# EAGLE design facedancer21+ (EAGLE 7.1.0)
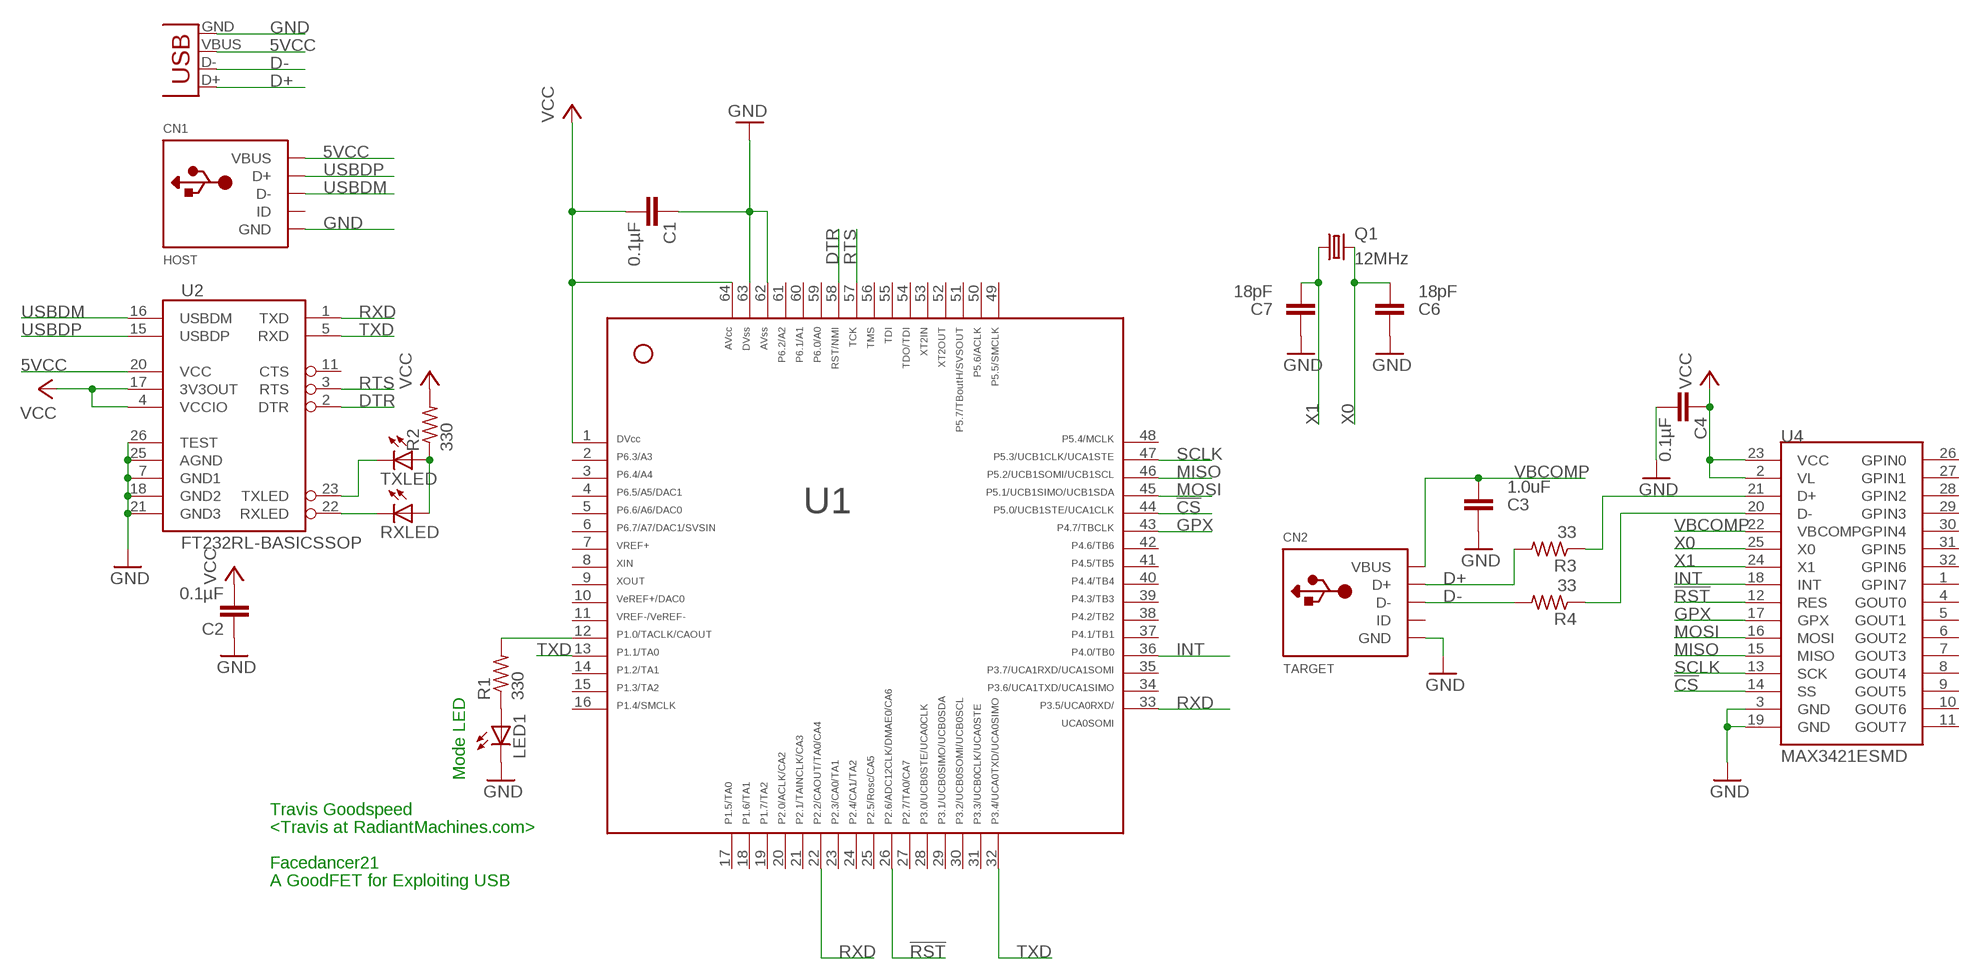
[diagram p0: schematic, sheet 1]

## Parts
C1  0.1µF  C-EUC0603  [C0603]
C2  0.1µF  C-EUC0603  [C0603]
C3  1.0uF  C-EUC0603  [C0603]
C4  0.1µF  C-EUC0603  [C0603]
C6  18pF  C-EUC0603  [C0603]
C7  18pF  C-EUC0603  [C0603]
CN1  HOST  USBMINIB  [USB-MINIB]
CN2  TARGET  USBMINIB  [USB-MINIB]
CN3  USB-A-S  [USB-A-S]
LED1  LEDCHIP-LED0603  [CHIP-LED0603]
Q1  12MHz  CRYSTALHC49UP  [HC49UP]
R1  330  R-US_R0603  [R0603]
R2  330  R-US_R0603  [R0603]
R3  33  R-US_R0603  [R0603]
R4  33  R-US_R0603  [R0603]
RXLED  LEDCHIP-LED0603  [CHIP-LED0603]
TXLED  LEDCHIP-LED0603  [CHIP-LED0603]
U1  F261X---PM64  [PM/PAG64]
U2  FT232RL-BASICSSOP  [SSOP28DB]
U4  MAX3421ESMD  [TQFP32-5MM]

## Nets
5VCC: CN1.VBUS CN3.VBUS U2.20(VCC)
!CS: U1.44 U4.14(SS)
!RST: U1.26 U4.12(RES)
D+: CN2.D+ CN3.D+ R3.2
D-: CN2.D- CN3.D- R4.2
DMINUS: R4.1 U4.20(D-)
DPLUS: R3.1 U4.21(D+)
DTR: U1.58 U2.2(DTR)
GND: C1.1 C2.1 C3.1 C4.2 C6.1 C7.1 CN1.GND CN2.GND CN3.GND LED1.C U1.62 U1.63 U2.7(GND1) U2.18(GND2) U2.21(GND3) U2.25(AGND) U2.26(TEST) U4.3(GND) U4.19(GND)
GPX: U1.43 U4.17(GPX)
INT: U1.36 U4.18(INT)
MISO: U1.46 U4.15(MISO)
MOSI: U1.45 U4.16(MOSI)
N$1: R1.2 U1.12
N$2: LED1.A R1.1
N$6: RXLED.C U2.22(RXLED)
N$7: TXLED.C U2.23(TXLED)
N$8: R2.1 RXLED.A TXLED.A
RTS: U1.57 U2.3(RTS)
RXD: U1.22 U1.33 U2.1(TXD)
SCLK: U1.47 U4.13(SCK)
TXD: U1.13 U1.32 U2.5(RXD)
USBDM: CN1.D- U2.16(USBDM)
USBDP: CN1.D+ U2.15(USBDP)
VBCOMP: C3.2 CN2.VBUS U4.22(VBCOMP)
VCC: C1.2 C2.2 C4.1 R2.2 U1.1 U1.64 U2.4(VCCIO) U2.17(3V3OUT) U4.2(VL) U4.23(VCC)
X0: C6.2 Q1.2 U4.25(X0)
X1: C7.2 Q1.1 U4.24(X1)
Unconnected: CN1.ID CN2.ID U1.2 U1.3 U1.4 U1.5 U1.6 U1.7 U1.8 U1.9 U1.10 U1.11 U1.14 U1.15 U1.16 U1.17 U1.18 U1.19 U1.20 U1.21 U1.23 U1.24 U1.25 U1.27 U1.28 U1.29 U1.30 U1.31 U1.34 U1.35 U1.37 U1.38 U1.39 U1.40 U1.41 U1.42 U1.48 U1.49 U1.50 U1.51 U1.52 U1.53 U1.54 U1.55 U1.56 U1.59 U1.60 U1.61 U2.11(CTS) U4.1(GPIN7) U4.4(GOUT0) U4.5(GOUT1) U4.6(GOUT2) U4.7(GOUT3) U4.8(GOUT4) U4.9(GOUT5) U4.10(GOUT6) U4.11(GOUT7) U4.26(GPIN0) U4.27(GPIN1) U4.28(GPIN2) U4.29(GPIN3) U4.30(GPIN4) U4.31(GPIN5) U4.32(GPIN6)

## Notes on the sheet
- Mode LED
- Travis Goodspeed
- <Travis at RadiantMachines.com>
- Facedancer21
- A GoodFET for Exploiting USB

## Library data of the parts
C1-C4 C6 C7 = rcl:C-EU: CAPACITOR, European symbol
CN1 CN2 = adafruit:USB: USB Connectors USBMINIB - Surface Mount Female Mini-B USB Connector 4UConnector: 06564 By microbuilder.eu Thru-hole RA Female Mini-B USB Connector 4UConnector: 18732 By ladyada.net
CN3 = SparkFun-Connectors:USB: USB Connectors USB-B-PTH is fully proven SKU : PRT-00139/CONN-08278 USB-miniB is fully proven SKU : PRT-00587 USB-A-PCB is untested. USB-A-H is throughly reviewed, but untested. Spark Fun Electronics SKU : PRT-00437 USB-B-SMT is throughly reviewed, but untested. Needs silkscreen touching up. USB-A-S has not been used/tested USB-MB-H has not been used/tested USB-MICROB has been used. CONN-09505
LED1 RXLED TXLED = led:LED: LED OSRAM: - CHIPLED LG R971, LG N971, LY N971, LG Q971, LY Q971, LO R971, LY R971 LH N974, LH R974 LS Q976, LO Q976, LY Q976 LO Q996 - Hyper CHIPLED LW Q18S LB Q993, LB Q99A, LB R99A - SideLED LS A670, LO A670, LY A670, LG A670, LP A670 LB A673, LV A673, LT A673, LW A673 LH A674 LY A675 LS A676, LA A676, LO A676, LY A676, LW A676 LS A679, LY A679, LG A679 - Hyper Micro SIDELED® LS Y876, LA Y876, LO Y876, LY Y876 LT Y87S - SmartLED LW L88C, LW L88S LB L89C, LB L89S, LG L890 LS L89K, LO L89K, LY L89K LS L896, LA L896, LO L896, LY L896 - TOPLED LS T670, LO T670, LY T670, LG T670, LP T670 LSG T670, LSP T670, LSY T670, LOP T670, LYG T670 LG T671, LOG T671, LSG T671 LB T673, LV T673, LT T673, LW T673 LH T674 LS T676, LA T676, LO T676, LY T676, LB T676, LH T676, LSB T676, LW T676 LB T67C, LV T67C, LT T67C, LS T67K, LO T67K, LY T67K, LW E67C LS E67B, LA E67B, LO E67B, LY E67B, LB E67C, LV E67C, LT E67C LW T67C LS T679, LY T679, LG T679 LS T770, LO T770, LY T770, LG T770, LP T770 LB T773, LV T773, LT T773, LW T773 LH T774 LS E675, LA E675, LY E675, LS T675 LS T776, LA T776, LO T776, LY T776, LB T776 LHGB T686 LT T68C, LB T68C - Hyper Mini TOPLED® LB M676 - Mini TOPLED Santana® LG M470 LS M47K, LO M47K, LY M47K Source: http://www.osram.convergy.de LUXEON: - LUMILED® LXK2-PW12-R00, LXK2-PW12-S00, LXK2-PW14-U00, LXK2-PW14-V00 LXK2-PM12-R00, LXK2-PM12-S00, LXK2-PM14-U00 LXK2-PE12-Q00, LXK2-PE12-R00, LXK2-PE12-S00, LXK2-PE14-T00, LXK2-PE14-U00 LXK2-PB12-K00, LXK2-PB12-L00, LXK2-PB12-M00, LXK2-PB14-N00, LXK2-PB14-P00, LXK2-PB14-Q00 LXK2-PR12-L00, LXK2-PR12-M00, LXK2-PR14-Q00, LXK2-PR14-R00 LXK2-PD12-Q00, LXK2-PD12-R00, LXK2-PD12-S00 LXK2-PH12-R00, LXK2-PH12-S00 LXK2-PL12-P00, LXK2-PL12-Q00, LXK2-PL12-R00 Source: www.luxeon.com KINGBRIGHT: KA-3528ASYC Source: www.kingbright.com
Q1 = crystal:CRYSTAL: CRYSTAL; OC_FARNELL: unknown; OC_NEWARK: unknown
R1-R4 = rcl:R-US_: RESISTOR, American symbol
U1 = TI_MSP430_v13:F261X---PM64: ***MSP430F261x***PM64
U2 = SparkFun:FT232RL-BASIC: USB UART This is the simplified version of the FT232RL unit. Only what you need, nothing you don't. Spark Fun Electronics SKU : COM-00650
U4 = SparkFun-DigitalIC:MAX3421E: USB Peripheral/Host Controller w/ SPI

## Board
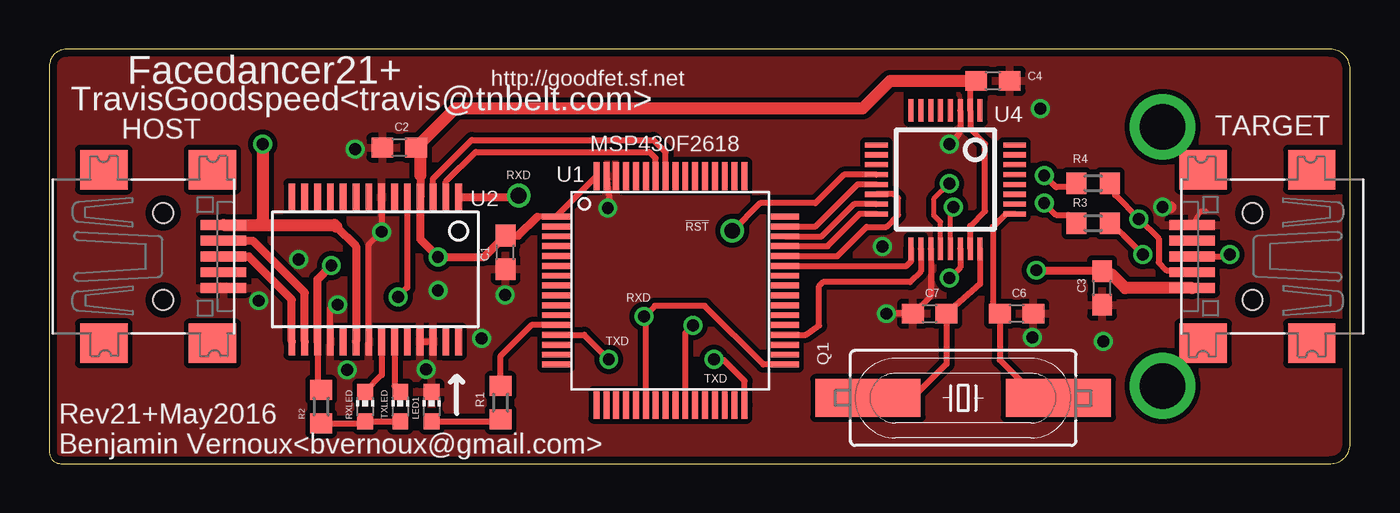
[diagram p1: board, top side]
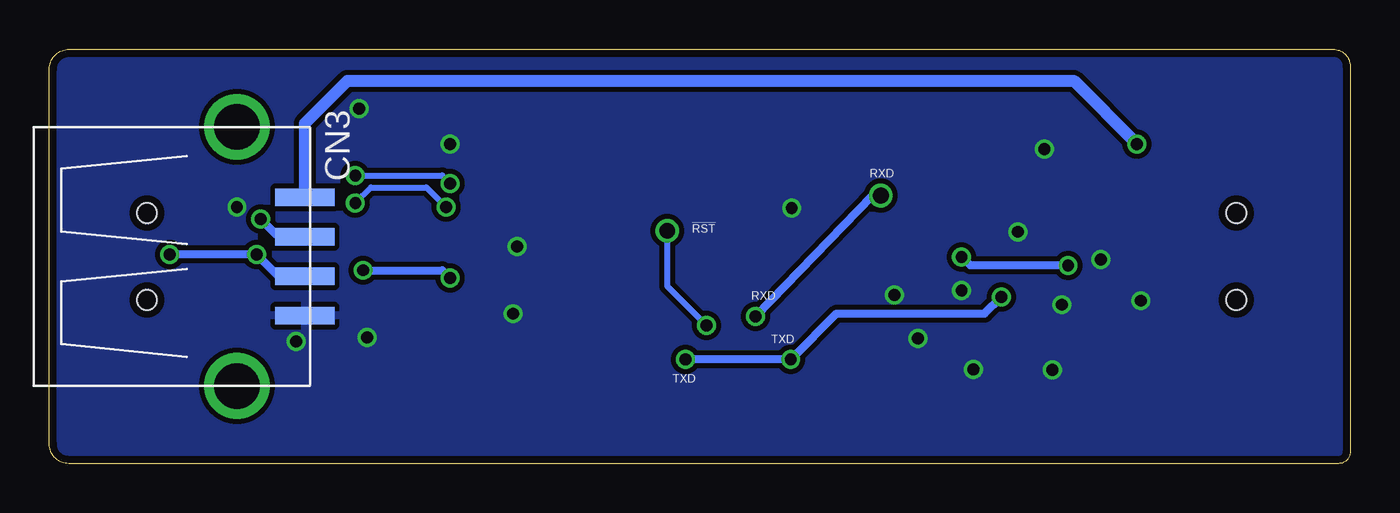
[diagram p2: board, bottom side, seen from below]

Size 65.9 x 21 mm. Coordinates in mm from the lower left corner, seen from the top.
Outline: 64.89,21 0.85,21 arc90 0,20.15 0,0.57 arc90 0.57,0 64.92,0 arc90 65.9,0.98 65.9,19.99 arc90 64.89,21
Copper layers (1*16): Top 0.0356mm / dielectric 1.5011mm / Bottom 0.0356mm
Design rules "oshpark-2layer": minimum track width 6mil, minimum drill 13mil, track to track 6mil, track to pad 6mil, pad to pad 6mil, via to via 6mil, smd to smd 6mil, copper to edge 15mil, drill to drill 6mil, minimum pad ring 7mil, minimum via ring 7mil, stop-mask expansion 2.5mil, vias tented up to drill 0mil, thermal gap 10mil

### Footprints (pad centres in the part's own frame; a part is rotated, then mirrored left to right if it is on the bottom)
C0603 = smd 1.1 x 1: 1 -0.85,0; 2 0.85,0
USB-MINIB = smd 0.5 x 2.308: D+ 0,4.064; D- -0.8,4.064; GND 1.6,4.064; ID 0.8,4.064; VBUS -1.6,4.064 | smd 2 x 2.4: GND1 -4.4,-2; GND2 -4.4,3.5; GND3 4.4,3.5; GND4 4.4,-2 | hole 1: -2.2,1; 2.2,1
USB-A-S = smd 3 x 0.9: D+ 3.45,-1; D- 3.45,1; GND 3.45,-3; VBUS 3.45,3 | drill 2.311: P$5 0,-6.566; P$6 0,6.566
CHIP-LED0603 = smd 0.8 x 0.8: A 0,-0.75; C 0,0.75
HC49UP = smd 5.334 x 1.93: 1 -4.826,0; 2 4.826,0
R0603 = smd 1 x 1.1: 1 -0.85,0; 2 0.85,0
PM/PAG64 = smd 1.4 x 0.3: 1 -5.8,3.75; 2 -5.8,3.25; 3 -5.8,2.75; 4 -5.8,2.25; 5 -5.8,1.75; 6 -5.8,1.25; 7 -5.8,0.75; 8 -5.8,0.25; 9 -5.8,-0.25; 10 -5.8,-0.75; 11 -5.8,-1.25; 12 -5.8,-1.75; 13 -5.8,-2.25; 14 -5.8,-2.75; 15 -5.8,-3.25; 16 -5.8,-3.75; 33 5.8,-3.75; 34 5.8,-3.25; 35 5.8,-2.75; 36 5.8,-2.25; 37 5.8,-1.75; 38 5.8,-1.25; 39 5.8,-0.75; 40 5.8,-0.25; 41 5.8,0.25; 42 5.8,0.75; 43 5.8,1.25; 44 5.8,1.75; 45 5.8,2.25; 46 5.8,2.75; 47 5.8,3.25; 48 5.8,3.75 | smd 0.3 x 1.4: 17 -3.75,-5.8; 18 -3.25,-5.8; 19 -2.75,-5.8; 20 -2.25,-5.8; 21 -1.75,-5.8; 22 -1.25,-5.8; 23 -0.75,-5.8; 24 -0.25,-5.8; 25 0.25,-5.8; 26 0.75,-5.8; 27 1.25,-5.8; 28 1.75,-5.8; 29 2.25,-5.8; 30 2.75,-5.8; 31 3.25,-5.8; 32 3.75,-5.8; 49 3.75,5.8; 50 3.25,5.8; 51 2.75,5.8; 52 2.25,5.8; 53 1.75,5.8; 54 1.25,5.8; 55 0.75,5.8; 56 0.25,5.8; 57 -0.25,5.8; 58 -0.75,5.8; 59 -1.25,5.8; 60 -1.75,5.8; 61 -2.25,5.8; 62 -2.75,5.8; 63 -3.25,5.8; 64 -3.75,5.8
SSOP28DB = smd 0.348 x 1.397: 1 -4.225,-3.656; 2 -3.575,-3.656; 3 -2.925,-3.656; 4 -2.275,-3.656; 5 -1.625,-3.656; 6 -0.975,-3.656; 7 -0.325,-3.656; 8 0.325,-3.656; 9 0.975,-3.656; 10 1.625,-3.656; 11 2.275,-3.656; 12 2.925,-3.656; 13 3.575,-3.656; 14 4.225,-3.656; 15 4.225,3.656; 16 3.575,3.656; 17 2.925,3.656; 18 2.275,3.656; 19 1.625,3.656; 20 0.975,3.656; 21 0.325,3.656; 22 -0.325,3.656; 23 -0.975,3.656; 24 -1.625,3.656; 25 -2.275,3.656; 26 -2.925,3.656; 27 -3.575,3.656; 28 -4.225,3.656
TQFP32-5MM = smd 1.143 x 0.254: 1 -3.5,1.75; 2 -3.5,1.25; 3 -3.5,0.75; 4 -3.5,0.25; 5 -3.5,-0.25; 6 -3.5,-0.75; 7 -3.5,-1.25; 8 -3.5,-1.75; 17 3.5,-1.75; 18 3.5,-1.25; 19 3.5,-0.75; 20 3.5,-0.25; 21 3.5,0.25; 22 3.5,0.75; 23 3.5,1.25; 24 3.5,1.75 | smd 0.254 x 1.143: 9 -1.75,-3.5; 10 -1.25,-3.5; 11 -0.75,-3.5; 12 -0.25,-3.5; 13 0.25,-3.5; 14 0.75,-3.5; 15 1.25,-3.5; 16 1.75,-3.5; 25 1.75,3.5; 26 1.25,3.5; 27 0.75,3.5; 28 0.25,3.5; 29 -0.25,3.5; 30 -0.75,3.5; 31 -1.25,3.5; 32 -1.75,3.5

### Placement (x,y rotation side)
C1  23.11,10.71 90 top
C2  17.73,16.02 0 top
C3  53.34,8.9 90 top
C4  47.8,19.4 0 top
C6  49,7.6 180 top
C7  44.6,7.6 0 top
CN1  4.76,10.5 270 top
CN2  61.96,10.5 90 top
CN3  56.4,10.5 0 bottom
LED1  19.37,2.89 0 top
Q1  46.3,3.33 0 top
R1  22.86,3.09 90 top
R2  13.77,2.89 90 top
R3  52.88,12.18 0 top
R4  52.88,14.21 0 top
RXLED  15.99,2.89 0 top
TXLED  17.78,2.89 0 top
U1  31.47,8.77 0 top
U2  16.51,9.84 180 top
U4  45.4,14.4 270 top

### Tracks (layer width: path | path; a pad name or v marks a point on that pad's centre or on a via)
5VCC  (via drill 0.6)
  Top 0.406: U2.20 15.54,11.02 14.55,12
  Top 0.61: CN1.VBUS 10.6,12.1 | 10.6,12.1 14.45,12.1 14.55,12 | v10.8,16.2 10.8,12.3 10.6,12.1
  Bottom 0.61: CN3.VBUS 52.95,17.25 50.8,19.4 14,19.4 v10.8,16.2
!CS
  Top 0.305: U4.14 42.8,13.65 43,13.45 43,12.6 42.4,12 41.4,12 39.92,10.52 U1.44
!RST  (via drill 0.6, 0.8)
  Top 0.305: U1.26 32.22,6.62 v32.6,7 | U4.12 40.25,14.65 38.8,13.2 36,13.2 v34.6,11.8
  Bottom 0.305: v34.6,11.8 34.6,9 v32.6,7
D+  (via drill 0.6)
  Top 0.305: R3.2 54.42,11.58 v55.4,10.6 | CN2.D+ 59.7,10.5 v59.8,10.6
  Bottom 0.406: CN3.D+ 54.2,9.4 v55.4,10.6 v59.8,10.6
D-  (via drill 0.6)
  Top 0.305: R4.2 54,13.6 v55.2,12.4 56.2,11.4 56.2,10.2 56.6,9.8 57.79,9.8 CN2.D- 57.79,9.6
  Bottom 0.406: v55.2,12.4 54.4,11.6 53.5,11.6 CN3.D-
DMINUS  (via drill 0.6)
  Top 0.254: v45.6,14.2 44.8,13.4 44.8,12.6 45.15,12.25 U4.20 | 51.83,14.01 R4.1
  Top 0.305: 51.83,14.01 50.99,14.01 v50.4,14.6
  Bottom 0.305: v50.4,14.6 46,14.6 v45.6,14.2
DPLUS  (via drill 0.6)
  Top 0.254: U4.21 45.65,12.85 v45.8,13
  Top 0.305: v50.4,13.2 51,12.6 51.61,12.6 R3.1
  Bottom 0.305: v50.4,13.2 49.6,14 46.8,14 v45.8,13
DTR
  Top 0.305: U2.2 20.09,14.29 21.6,15.8 30.4,15.8 30.72,15.48 U1.58
GND  (via drill 0.6)
  Top 0.254: U2.7 16.84,13.34 16.83,13.34 | CN2.GND 58.33,12.8 58.6,12.8
  Top 0.305: U4.3 46.15,16.95 46,16.6 v45.6,16.2 | U2.18 14.23,7.88 | v42.4,7.6 C7.1 44.65,8.5 U4.19 | U2.21 16.18,11.11 v16.83,11.75 16.83,13.34 | U2.25 U2.26 | U1.63 28.42,12.82 v28.29,12.95
  Top 0.61: v56.4,13 56.8,13
  other vias: 14.61,8.05 19.68,8.77 53.4,6.2 49.8,6.4 50.2,18 10.61,8.26 23.09,8.55 15.49,15.95 42.2,11 19.09,4.77 21.89,6.35 15.09,4.75 12.63,10.35
  pour Bottom (isolate 0.254): -0.99,-0.68 67.97,-0.88 67.77,22.28 -1.19,22.28
  pour Top (isolate 0.254): -0.6,21.6 67.2,21.4 67.4,-0.4 -0.4,-0.2
GPX
  Top 0.305: U4.17 43.65,10.25 43.42,10.02 U1.43
INT
  Top 0.305: U4.18 44.15,9.75 43.6,9.2 39.2,9.2 39,9 39,7 38.32,6.52 U1.36
MISO
  Top 0.305: U4.15 40.75,13.15 39.12,11.52 U1.46
MOSI
  Top 0.305: U1.45 39.42,11.02 41.05,12.65 U4.16
N$1
  Top 0.305: R1.2 22.86,5.46 24.42,7.02 U1.12
N$2
  Top 0.305: LED1.A 22.76,2.14 R1.1
N$6
  Top 0.305: U2.22 16.84,4.49 RXLED.C
N$7
  Top 0.305: U2.23 17.48,3.94 TXLED.C
N$8
  Top 0.305: R2.1 15.89,2.04 RXLED.A TXLED.A
RTS
  Top 0.305: U2.3 19.43,14.44 21.4,16.4 30.6,16.4 31.22,15.78 U1.57
RXD  (via drill 0.6, 0.8)
  Top 0.305: U1.22 30.22,7.37 v30.13,7.46 30.67,8 33.2,8 36.18,5.02 U1.33
  Top 0.406: U2.1 23.69,13.5 v23.78,13.58
  Bottom 0.406: v23.78,13.58 24.2,13.58 v30.13,7.46
SCLK
  Top 0.305: U4.13 40.95,14.15 38.82,12.02 U1.47
TXD  (via drill 0.6)
  Top 0.305: U2.5 18.14,8.93 v17.66,8.46 | U1.32 35.22,4.18 34.12,5.28 v33.66,5.28 | U1.13 27.1,6.52 v28.34,5.28
  Bottom 0.254: 27.39,6.23 v28.34,5.28
  Bottom 0.305: 27.39,6.23 27.37,6.23
  Bottom 0.406: v33.66,5.28 v28.34,5.28 26.02,7.6 18.52,7.6 v17.66,8.46
USBDM
  Top 0.406: U2.16 12.94,8.66 10.3,11.3 CN1.D-
USBDP
  Top 0.406: U2.15 12.29,8.31 10.1,10.5 CN1.D+
VBCOMP  (via drill 0.6)
  Top 0.305: U4.22 46.15,9.95 v45.6,9.4
  Top 0.406: v50,9.8 53.29,9.8 C3.2
  Top 0.61: CN2.VBUS 54.5,8.9 53.8,9.6 53.49,9.6 C3.2
  Bottom 0.406: v50,9.8 46,9.8 v45.6,9.4
VCC  (via drill 0.6)
  Top 0.254: U2.4
  Top 0.305: U2.17 13.59,3.36 R2.2 | U4.23 46.65,12.05 47.4,12.8 47.4,16.2 46.65,16.95 U4.2 46.65,19.3 C4.1 | U1.64 U1.1 24.72,12.52 | 18.79,15.81 C2.2
  Top 0.406: 18.8,14.6 18.8,13.51 U2.4 18.79,11.38 v19.68,10.48 22.03,10.48 C1.2 | 23.11,11.6 C1.2 | C1.2 23.76,11.56 24.72,12.52 | U2.17 13.59,9.34 v14.29,10.04
  Top 0.61: C4.1 42.6,19.4 41.2,18 20.55,18 C2.2 | 18.79,15.81 18.79,14.62 18.8,14.6
  Bottom 0.406: v14.29,10.04 19.25,10.04 v19.68,10.48
X0
  Top 0.305: U4.25 48.45,12.65 47.8,12 47.8,7.95 C6.2 48.15,5.25 49.8,3.6 51.45,3.6 Q1.2
X1
  Top 0.305: U4.24 47.15,9.1 C7.2 45.45,5.05 43.8,3.4 42.14,3.4 Q1.1

### Text on the board
tNames: Facedancer21+ | http://goodfet.sf.net | TravisGoodspeed<travis@tnbelt.com> | MSP430F2618 | RXD | !RST | RXD | TXD | TXD | Rev21+May2016 / Benjamin Vernoux<bvernoux@gmail.com>
bNames: RXD | !RST | RXD | TXD | TXD